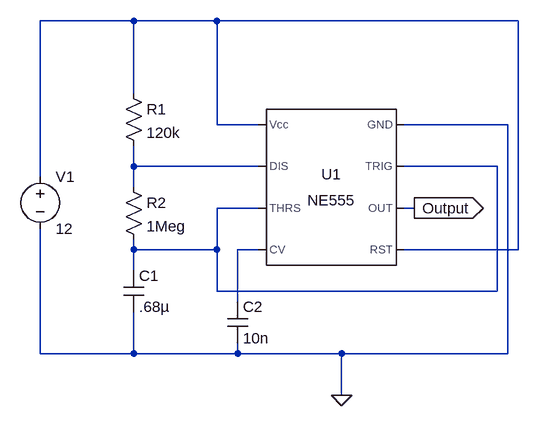
[diagram p0: schematic 555_Timer.asc]
555_Timer.asc, the LTspice schematic file:
Version 4
SHEET 1 880 680
WIRE -144 -112 -288 -112
WIRE -16 -112 -144 -112
WIRE 448 -112 -16 -112
WIRE -144 0 -144 -112
WIRE -16 48 -16 -112
WIRE 48 48 -16 48
WIRE 432 48 272 48
WIRE -144 112 -144 80
WIRE 48 112 -144 112
WIRE 416 112 272 112
WIRE -288 128 -288 -112
WIRE -144 144 -144 112
WIRE 48 176 -16 176
WIRE 288 176 272 176
WIRE -144 240 -144 224
WIRE -16 240 -16 176
WIRE -16 240 -144 240
WIRE 48 240 16 240
WIRE 448 240 448 -112
WIRE 448 240 272 240
WIRE -144 272 -144 240
WIRE -16 304 -16 240
WIRE 416 304 416 112
WIRE 416 304 -16 304
WIRE 16 320 16 240
WIRE -288 400 -288 208
WIRE -144 400 -144 336
WIRE -144 400 -288 400
WIRE 16 400 16 384
WIRE 16 400 -144 400
WIRE 176 400 16 400
WIRE 432 400 432 48
WIRE 432 400 176 400
WIRE 176 464 176 400
FLAG 176 464 0
FLAG 288 176 Output
IOPIN 288 176 Out
SYMBOL res -160 -16 R0
SYMATTR InstName R1
SYMATTR Value 120k
SYMATTR SpiceLine tol=5
SYMBOL res -160 128 R0
SYMATTR InstName R2
SYMATTR Value 1Meg
SYMATTR SpiceLine tol=5 pwr=0.1
SYMBOL cap -160 272 R0
SYMATTR InstName C1
SYMATTR Value .68µ
SYMBOL voltage -288 112 R0
WINDOW 123 0 0 Left 0
WINDOW 39 0 0 Left 0
SYMATTR InstName V1
SYMATTR Value 12
SYMBOL Misc\\NE555 160 144 M0
SYMATTR InstName U1
SYMBOL cap 0 320 R0
SYMATTR InstName C2
SYMATTR Value 10n

The netlist it stands for:
* 555_Timer.asc
R1 N001 N002 120k tol=5
R2 N002 N003 1Meg tol=5 pwr=0.1
C1 N003 0 .68µ
V1 N001 0 12
XU1 0 N003 Output N001 N004 N003 N002 N001 NE555  ; pins GND TRIG OUT RST CV THRS DIS Vcc
C2 N004 0 10n
.lib NE555.sub
.backanno
.end